# Altium schematic sheet SHT30.SchDoc
size A4; SheetNumber: 1; SheetTotal: 1
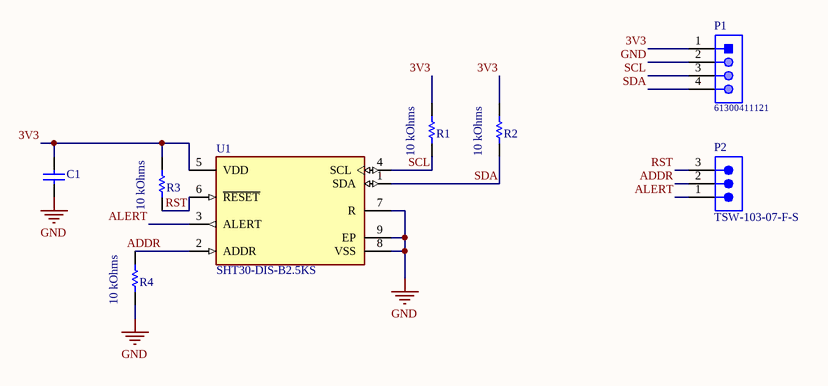
[diagram p0: SHT30.SchDoc]

## Parts
C1  C0805C106K4PACTU  [CAPC2013X140X50ML20T25]  (value not drawn)
P1  61300411121  [61300411121]
P2  TSW-103-07-F-S  [SMTC-TSW-103-07-X-S]
R1  10 kOhms  [RESC2013X60X30ML20T20]
R2  10 kOhms  [RESC2013X60X30ML20T20]
R3  10 kOhms  [RESC2013X60X30ML20T20]
R4  10 kOhms  [RESC2013X60X30ML20T20]
U1  SHT30-DIS-B2.5KS  [FP-SHT30-DIS-B2_5KS-IPC_A]

## Nets
GND: C1.1 P1.2 R4.2 U1.7(R) U1.8(VSS) U1.9(EP)
3V3: C1.2 P1.1 R1.1 R2.1 R3.1 U1.5(VDD)
ADDR: P2.2 R4.1 U1.2(ADDR)
ALERT: P2.1 U1.3(ALERT)
RST: P2.3 R3.2 U1.6(~{RESET})
SCL: P1.3 R1.2 U1.4(SCL)
SDA: P1.4 R2.2 U1.1(SDA)

## Library data of the parts
C1 = CMP-2007-03242-1: 10µF ±10% 16V Ceramic Capacitor X5R 0805 (2012 Metric); Part Number: CL21A106KOQNNNG
P1 = CMP-1502-01064-1: THT Vertical Pin Header WR-PHD, Pitch 2.54 mm, Single Row, 4 pins; Manufacturer: Wurth Elektronik; Withstanding Voltage: 500VAC; Rated Current: 3A; Working Voltage: 250VAC; Pin Number: 4; Gender: Male; Contact Resistance: 20mOhm; Pitch: 2.54mm; Manufacturer URL: http://www.we-online.de; Operating Temperature: -40to105degC; Packaging: Bag; Mounting Technology: THT; Package Reference: 61300411121; Datasheet URL: https://katalog.we-online.de/em/datasheet/6130xx11121.pdf; Publisher: WurthElektronik; Part Number: 61300411121; Row Number: Single; Orientation: Vertical
P2 = CMP-1024-00331-1: 0.025" SQ Post Header, Through-hole, Vertical, -55 to 125 degC, 2.54 mm Pitch, 3-Pin, Male, RoHS; Manufacturer: Samtec; Pitch: 2.54 mm; DatasheetVersion: F-214; ComponentLink1Description: Manufacturer URL; ComponentLink3URL: http://www.samtec.com/documents/webfiles/cpdf/TSW-XXX-XX-XXX-X-XX-XXX-MKT.pdf; Mounting Technology: Through-hole; PackageDescription: .025[0.64] SQ. Post Terminal Strip Assembly; Temperature Range: -55 to 125 degC; ComponentLink3Description: Package Specification; Orientation: Vertical; PartNumber: TSW-103-07-F-S; RoHS: True; PackageVersion: DM, 8/1988; ComponentLink2Description: Datasheet; ComponentLink1URL: http://www.samtec.com; ComponentLink2URL: http://www.samtec.com/documents/webfiles/pdf/TSW_TH.PDF; PackageReference: TSW-103-07-X-S
R1-R4 = CMP-2001-04657-1: 10 kOhms ±5% 0.25W, 1/4W Chip Resistor 0805 (2012 Metric) Automotive AEC-Q200, Moisture Resistant Thick Film; Part Number: RK73B2ATTD103J; Manufacturer: KOA Speer
U1 = CMP-144040-000006-1: SENSOR HUMID/TEMP 5V I2C 3% SMD